# Altium project nizn.PrjPCB
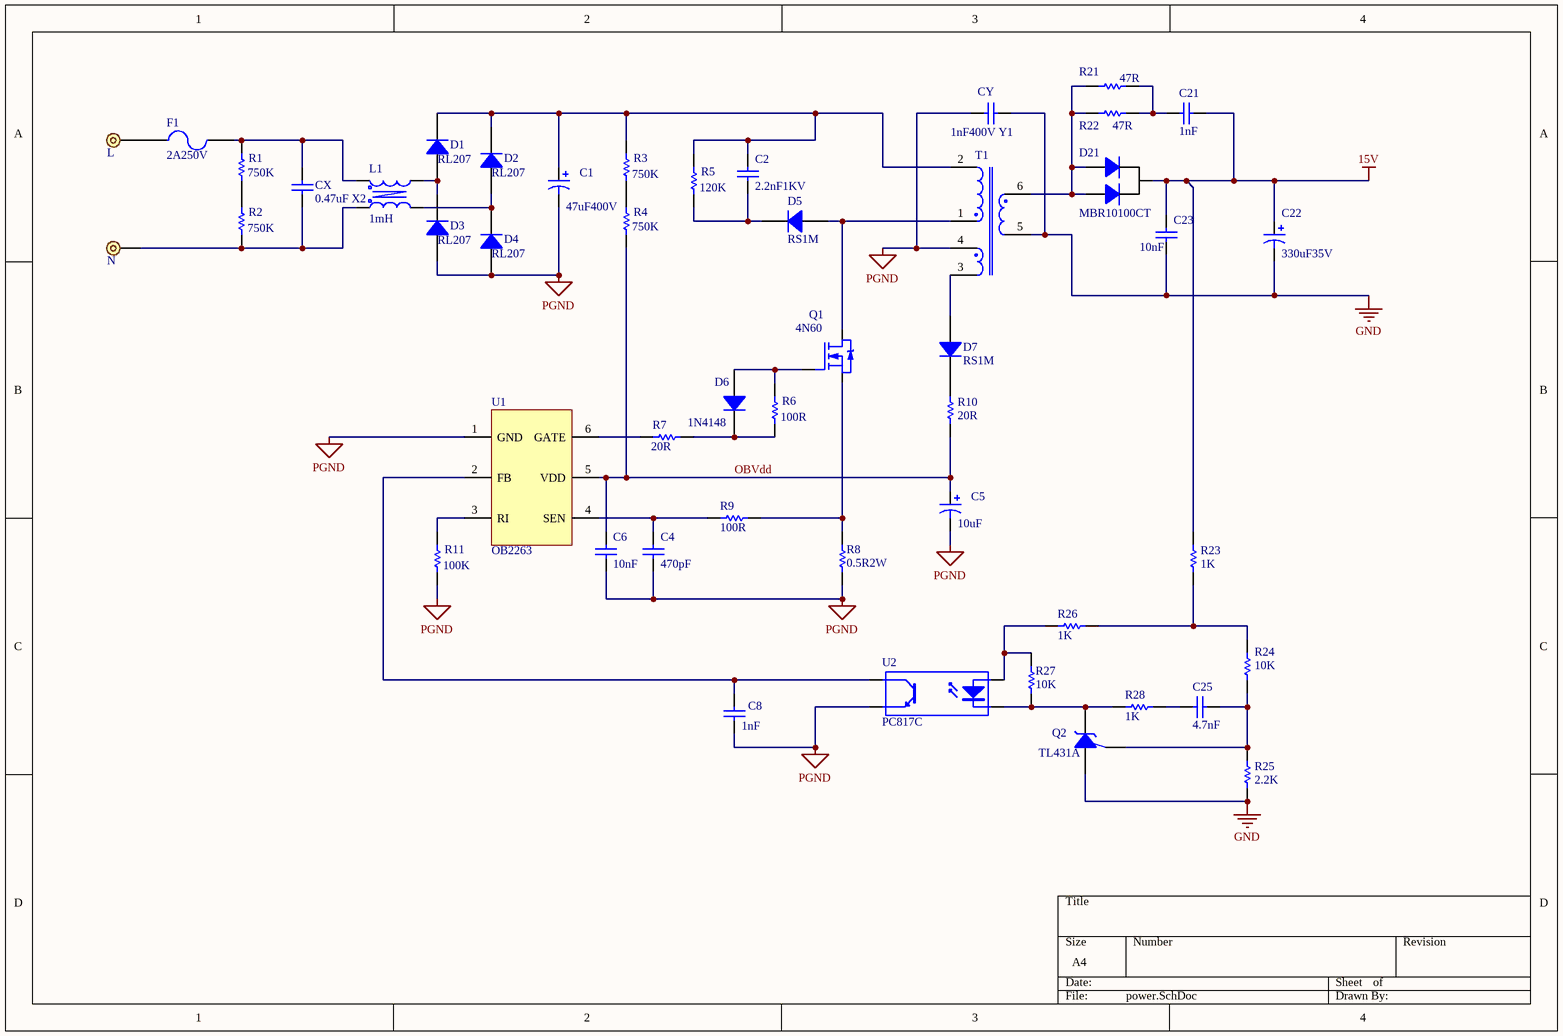
[diagram p0: power.SchDoc]
2 sheets, 86 parts. Net scope: global (net labels, ports and power ports of the same name join across sheets).
Board file: nizn.PcbDoc
Sheets:
  power.SchDoc
  charger.SchDoc

## Sheet power.SchDoc
size A4; PageSetup: Record=PageOptions|CenterHorizontal=True|CenterVertical=True|PrintScale=0.97|XCorrection=1.00|YCorrection=1.00|PrintKind=0|BorderSize=5000000|LeftOffset=0|BottomOffset=0|Orientation=2|PaperLength=1000|PaperWidth=1000|Scale=100|PaperSource=7|PrintQuality=-4|MediaType=1|DitherType=10|PaperKind=A4|PrintScaleMode=1

### Parts
C1  47uF400V  [CAP16x25]
C2  value 2.2nF1KV  [CAP5]  (hidden comment: Cap)
C4  value 470pF  [CAP0805]  (hidden comment: Cap)
C5  10uF  [CAP3]
C6  value 10nF  [CAP0805]  (hidden comment: Cap)
C8  value 1nF  [CAP0805]  (hidden comment: Cap)
C21  value 1nF  [CAP1206]  (hidden comment: Cap)
C22  330uF35V  [CAP10X16]
C23  value 10nF  [CAP0805]  (hidden comment: Cap)
C25  value 4.7nF  [CAP0805]  (hidden comment: Cap)
CX  value 0.47uF X2  [CAPX2]  (hidden comment: Cap)
CY  value 1nF400V Y1  [CAPY2]  (hidden comment: Cap)
D1  RL207  [DIO10mm]
D2  RL207  [DIO10mm]
D3  RL207  [DIO10mm]
D4  RL207  [DIO10mm]
D5  RS1M  [DO214A]
D6  1N4148  [1N4148SMT]
D7  RS1M  [DO214A]
D21  MBR10100CT  [TO220DIO_HS]
F1  2A250V  [FUSE3X10_2]
J1  L  [PAD1]
J2  N  [PAD1]
L1  1mH  [BU10]
Q1  4N60  [TO220MOS_HS]
Q2  TL431A  [SOT23_431]
R1  value 750K  [RES1206]  (hidden comment: Res1)
R2  value 750K  [RES1206]  (hidden comment: Res1)
R3  value 750K  [RES1206]  (hidden comment: Res1)
R4  value 750K  [RES1206]  (hidden comment: Res1)
R5  value 120K  [RES1206]  (hidden comment: Res1)
R6  value 100R  [RES0805]  (hidden comment: Res1)
R7  value 20R  [RES0805]  (hidden comment: Res1)
R8  value 0.5R2W  [RES2W]  (hidden comment: Res1)
R9  value 100R  [RES0805]  (hidden comment: Res1)
R10  value 20R  [RES1206]  (hidden comment: Res1)
R11  value 100K  [RES0805]  (hidden comment: Res1)
R21  value 47R  [RES1206]  (hidden comment: Res1)
R22  value 47R  [RES1206]  (hidden comment: Res1)
R23  value 1K  [RES0805]  (hidden comment: Res1)
R24  value 10K  [RES0805]  (hidden comment: Res1)
R25  value 2.2K  [RES0805]  (hidden comment: Res1)
R26  value 1K  [RES0805]  (hidden comment: Res1)
R27  value 10K  [RES0805]  (hidden comment: Res1)
R28  value 1K  [RES0805]  (hidden comment: Res1)
T1  Transformer  [PQ20C1]  (value not drawn)
U1  OB2263  [SOT23-6]
U2  PC817C  [DIP-4]

### Nets
15V: C21.1 C22.1 C23.2 D21.2(K) R23.1
GND: C22.2 C23.1 CY.1 Q2.2(A) R25.1 T1.5
PGND: C1.2 C4.1 C5.2 C6.1 C8.1 CY.2 D3.1(A) D4.1(A) R8.2 R11.1 T1.4 U1.1(GND) U2.3(E)
OBVdd: C5.1 C6.2 R4.1 R10.2 U1.5(VDD)
NetC1_1: C1.1 C2.2 D1.2(K) D2.2(K) R3.2 R5.2 T1.2
NetC2_1: C2.1 D5.2(K) R5.1
NetC4_2: C4.2 R9.2 U1.4(SEN)
NetC8_2: C8.2 U1.2(FB) U2.4(C)
NetC21_2: C21.2 R21.1 R22.1
NetC25_1: C25.1 Q2.1(R) R24.1 R25.2
NetC25_2: C25.2 R28.1
NetCX_1: CX.1 J2.1 L1.4 R2.1
NetCX_2: CX.2 F1.2 L1.1 R1.2
NetD1_1: D1.1(A) D3.2(K) L1.2
NetD2_1: D2.1(A) D4.2(K) L1.3
NetD5_1: D5.1(A) Q1.D T1.1
NetD6_1: D6.1(A) Q1.G R6.2
NetD6_2: D6.2(K) R6.1 R7.1
NetD7_1: D7.1(A) T1.3
NetD7_2: D7.2(K) R10.1
NetD21_1: D21.1(A) D21.3(A) R21.2 R22.2 T1.6
NetF1_1: F1.1 J1.1
NetQ1_S: Q1.S R8.1 R9.1
NetQ2_3: Q2.3(C) R27.1 R28.2 U2.2(K)
NetR1_1: R1.1 R2.2
NetR3_1: R3.1 R4.2
NetR7_2: R7.2 U1.6(GATE)
NetR11_2: R11.2 U1.3(RI)
NetR23_2: R23.2 R24.2 R26.2
NetR26_1: R26.1 R27.2 U2.1(A)

### Library data of the parts
C1 C5 C22 = Cap Pol2: 电解电容; Published: 8-Jun-2000; LatestRevisionDate: 17-Jul-2002; LatestRevisionNote: Re-released for DXP Platform.; Publisher: Altium Limited
C2 = Cap: 涤纶电容; Published: 8-Jun-2000; LatestRevisionDate: 17-Jul-2002; LatestRevisionNote: Re-released for DXP Platform.; PackageReference: RAD-0.3; Publisher: Altium Limited; PackageDescription: Radial Cap, Thru-Hole; 2 Leads; 0.3 in Pin Spacing
C4 C6 C8 C21 C23 C25 = Cap: 贴片电容; Published: 8-Jun-2000; LatestRevisionDate: 17-Jul-2002; LatestRevisionNote: Re-released for DXP Platform.; PackageReference: RAD-0.3; Publisher: Altium Limited; PackageDescription: Radial Cap, Thru-Hole; 2 Leads; 0.3 in Pin Spacing
CX = Cap: X2 安规电容; Published: 8-Jun-2000; LatestRevisionDate: 17-Jul-2002; LatestRevisionNote: Re-released for DXP Platform.; PackageReference: RAD-0.3; Publisher: Altium Limited; PackageDescription: Radial Cap, Thru-Hole; 2 Leads; 0.3 in Pin Spacing
CY = Cap: Y2 安规电容; Published: 8-Jun-2000; LatestRevisionDate: 17-Jul-2002; LatestRevisionNote: Re-released for DXP Platform.; PackageReference: RAD-0.3; Publisher: Altium Limited; PackageDescription: Radial Cap, Thru-Hole; 2 Leads; 0.3 in Pin Spacing
D1-D4 = Diode: 直插二极管; Published: 8-Jun-2000; LatestRevisionDate: 17-Jul-2002; LatestRevisionNote: Re-released for DXP Platform.; DatasheetDocument: 1999; PackageDocument: Aug-1999; PackageReference: DO-41; Publisher: Altium Limited; ComponentLink1Description: Manufacturer Link; ComponentLink1URL: http://www.fairchildsemi.com/; Code_JEDEC: DO-204-AL
D5-D7 = Diode: 贴片二极管; Published: 8-Jun-2000; LatestRevisionDate: 17-Jul-2002; LatestRevisionNote: Re-released for DXP Platform.; DatasheetDocument: 1999; PackageDocument: Aug-1999; PackageReference: DO-41; Publisher: Altium Limited; ComponentLink1Description: Manufacturer Link; ComponentLink1URL: http://www.fairchildsemi.com/; Code_JEDEC: DO-204-AL
D21 = Diode2: 整流双二极管; Published: 8-Jun-2000; LatestRevisionDate: 17-Jul-2002; LatestRevisionNote: Re-released for DXP Platform.; DatasheetDocument: 1999; PackageDocument: Aug-1999; PackageReference: DO-41; Publisher: Altium Limited; ComponentLink1Description: Manufacturer Link; ComponentLink1URL: http://www.fairchildsemi.com/; Code_JEDEC: DO-204-AL
F1 = Fuse 2: 直插保险丝; Published: 8-Jun-2000; LatestRevisionDate: 17-Jul-2002; LatestRevisionNote: Re-released for DXP Platform.; Publisher: Altium Limited
J1 = Header1: 电源火线; LatestRevisionDate: 17-Jul-2002; LatestRevisionNote: Re-released for DXP Platform.; Publisher: Altium Limited
J2 = Header1: 电源零线; LatestRevisionDate: 17-Jul-2002; LatestRevisionNote: Re-released for DXP Platform.; Publisher: Altium Limited
L1 = TRANS3: 共模电感
Q1 = NMOS: 高压 NMOS; Published: 8-Jun-2000; LatestRevisionDate: 17-Jul-2002; LatestRevisionNote: Re-released for DXP Platform.; PackageVersion: 1995/1996; PackageReference: E3; Publisher: Altium Limited; PackageDescription: TO, Flat Index; 3 In-Line, Axial Leads; Body Dia. 4.6mm; Lead Dia. 0.5 mm (max)
Q2 = TL431: 基准集成电路; Accuracy: 0.5%; Published: 8-Jun-2000; LatestRevisionDate: 17-Jul-2002; LatestRevisionNote: Re-released for DXP Platform.; Publisher: Altium Limited
R1-R7 R9-R11 R21 R22 = Res1: 贴片电阻; Accuracy: 5%; Published: 8-Jun-2000; LatestRevisionDate: 17-Jul-2002; LatestRevisionNote: Re-released for DXP Platform.; PackageReference: AXIAL-0.3; Publisher: Altium Limited; PackageDescription: Axial Device, Thru-Hole; 2 Leads; 0.3 in Pin Spacing
R8 = Res1: 2W 直插电阻; Published: 8-Jun-2000; LatestRevisionDate: 17-Jul-2002; LatestRevisionNote: Re-released for DXP Platform.; PackageReference: AXIAL-0.3; Publisher: Altium Limited; PackageDescription: Axial Device, Thru-Hole; 2 Leads; 0.3 in Pin Spacing
R23-R28 = Res1: 贴片电阻; Accuracy: 1%; Published: 8-Jun-2000; LatestRevisionDate: 17-Jul-2002; LatestRevisionNote: Re-released for DXP Platform.; PackageReference: AXIAL-0.3; Publisher: Altium Limited; PackageDescription: Axial Device, Thru-Hole; 2 Leads; 0.3 in Pin Spacing
T1 = PQ20C1: 变压器; Published: 24-Mar-1999; LatestRevisionDate: 17-Jul-2002; LatestRevisionNote: Re-released for DXP Platform.; Publisher: Altium Limited
U1 = OB2263: 集成电路
U2 = Optoisolator1: 光耦; Published: 24-Mar-1999; LatestRevisionDate: 4-Mar-2005; LatestRevisionNote: Sch pins 3 & 4 Swapped.; DatasheetDocument: Nov-2003; PackageReference: DIP-4; Publisher: Altium Limited

## Sheet charger.SchDoc
size A4; PageSetup: Record=PageOptions|CenterHorizontal=True|CenterVertical=True|PrintScale=0.97|XCorrection=1.00|YCorrection=1.00|PrintKind=0|BorderSize=5000000|LeftOffset=0|BottomOffset=0|Orientation=2|PaperLength=1000|PaperWidth=1000|Scale=100|PaperSource=7|PrintQuality=-4|MediaType=1|DitherType=10|PaperKind=A4|PrintScaleMode=1
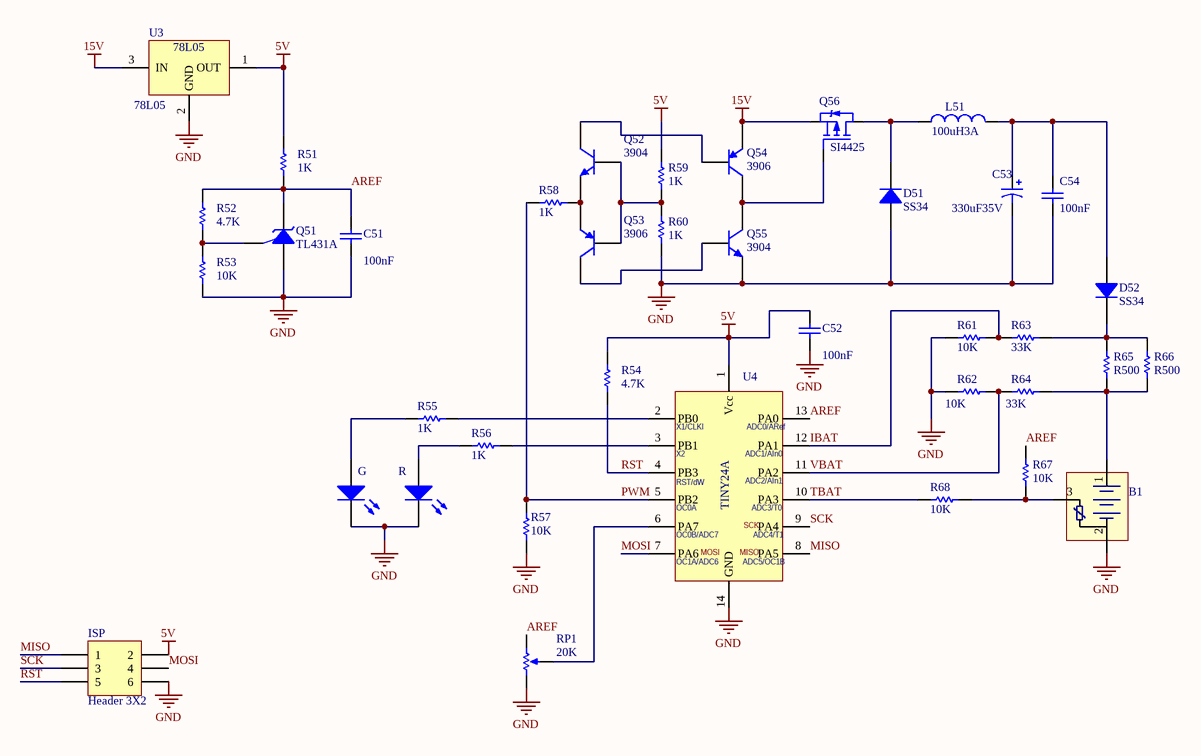
[diagram p1: charger.SchDoc]

### Parts
B1  BATT  [BATT]  (value not drawn)
C51  value 100nF  [CAP0805]  (hidden comment: Cap)
C52  value 100nF  [CAP0805]  (hidden comment: Cap)
C53  330uF35V  [CAP10x16]
C54  value 100nF  [CAP0805]  (hidden comment: Cap)
D51  SS34  [DO214A]
D52  SS34  [DO214A]
G  高亮翠绿  [LED2G_SLIM]  (value not drawn)
ISP  Header 3X2  [HDR2X3_EMPTY]
L51  100uH3A  [INDUCTOR]
Q51  TL431A  [SOT23_431]
Q52  3904  [SOT23_CBE]
Q53  3906  [SOT23_CBE]
Q54  3906  [SOT23_CBE]
Q55  3904  [SOT23_CBE]
Q56  SI4425  [SO8-MOS]
R  高亮红  [LED2R_SLIM]  (value not drawn)
R51  value 1K  [RES0805]  (hidden comment: Res1)
R52  value 4.7K  [RES0805]  (hidden comment: Res1)
R53  value 10K  [RES0805]  (hidden comment: Res1)
R54  value 4.7K  [RES0805]  (hidden comment: Res1)
R55  value 1K  [RES0805]  (hidden comment: Res1)
R56  value 1K  [RES0805]  (hidden comment: Res1)
R57  value 10K  [RES0805]  (hidden comment: Res1)
R58  value 1K  [RES0805]  (hidden comment: Res1)
R59  value 1K  [RES0805]  (hidden comment: Res1)
R60  value 1K  [RES0805]  (hidden comment: Res1)
R61  value 10K  [RES0805]  (hidden comment: Res1)
R62  value 10K  [RES0805]  (hidden comment: Res1)
R63  value 33K  [RES0805]  (hidden comment: Res1)
R64  value 33K  [RES0805]  (hidden comment: Res1)
R65  value R500  [RES2512]  (hidden comment: Res1)
R66  value R500  [RES2512]  (hidden comment: Res1)
R67  value 10K  [RES0805]  (hidden comment: Res1)
R68  value 10K  [RES0805]  (hidden comment: Res1)
RP1  value 20K  [POT3x3]  (hidden comment: RPot)
U3  78L05  [SOT89_VREG]
U4  TINY24A  [SO14]  (value not drawn)

### Nets
5V: C52.2 ISP.2 R51.2 R54.2 R59.2 U3.1(OUT) U4.1(Vcc)
15V: Q54.E Q56.S U3.3(IN)
GND: B1.2(B-) C51.1 C52.1 C53.2 C54.1 D51.1(A) G.2(K) ISP.6 Q51.2(A) Q55.E R.2(K) R53.1 R57.2 R60.1 R61.2 R62.2 RP1.1(TOP) U3.2(GND) U4.14(GND)
AREF: C51.2 Q51.3(C) R51.1 R52.2 R67.2 RP1.2(BOT) U4.13(PA0)
IBAT: R61.1 R63.2 U4.12(PA1)
MISO: ISP.1 U4.8(PA5)
MOSI: ISP.4 U4.7(PA6)
PWM: R57.1 R58.2 U4.5(PB2)
RST: ISP.5 R54.1 U4.4(PB3)
SCK: ISP.3 U4.9(PA4)
TBAT: R68.2 U4.10(PA3)
VBAT: R62.1 R64.2 U4.11(PA2)
NetB1_1: B1.1(B+) R64.1 R65.1 R66.1
NetB1_3: B1.3(T) R67.1 R68.1
NetC53_1: C53.1 C54.2 D52.1(A) L51.2
NetD51_2: D51.2(K) L51.1 Q56.D
NetD52_2: D52.2(K) R63.1 R65.2 R66.2
NetG_1: G.1(A) R55.2
NetQ51_1: Q51.1(R) R52.1 R53.2
NetQ52_B: Q52.B Q53.B R59.1 R60.2
NetQ52_C: Q52.C Q54.B
NetQ52_E: Q52.E Q53.E R58.1
NetQ53_C: Q53.C Q55.B
NetQ54_C: Q54.C Q55.C Q56.G
NetR55_1: R55.1 U4.2(PB0)
NetR56_1: R56.1 U4.3(PB1)
NetR_1: R.1(A) R56.2
NetRP1_3: RP1.3(TAP) U4.6(PA7)

### Notes on the sheet
- (in symbol TINY13A) X1/CLKI; ADC0/ARef; X2; ADC1/AIn0; RST/dW; ADC2/AIn1; OC0A; ADC3/T0; SCK; OC0B/ADC7; ADC4/T1; MOSI; MISO; OC1A/ADC6; ADC5/OC1B

### Library data of the parts
B1 = BATT: 电池座
C51 C52 C54 = Cap: 贴片电容; Published: 8-Jun-2000; LatestRevisionDate: 17-Jul-2002; LatestRevisionNote: Re-released for DXP Platform.; PackageReference: RAD-0.3; Publisher: Altium Limited; PackageDescription: Radial Cap, Thru-Hole; 2 Leads; 0.3 in Pin Spacing
C53 = Cap Pol2: 电解电容; Published: 8-Jun-2000; LatestRevisionDate: 17-Jul-2002; LatestRevisionNote: Re-released for DXP Platform.; Publisher: Altium Limited
D51 D52 = Diode: 贴片二极管; Published: 8-Jun-2000; LatestRevisionDate: 17-Jul-2002; LatestRevisionNote: Re-released for DXP Platform.; DatasheetDocument: 1999; PackageDocument: Aug-1999; PackageReference: DO-41; Publisher: Altium Limited; ComponentLink1Description: Manufacturer Link; ComponentLink1URL: http://www.fairchildsemi.com/; Code_JEDEC: DO-204-AL
G R = LED: 贴片二极管 0805; Published: 8-Jun-2000; LatestRevisionDate: 08-Jul-2005; LatestRevisionNote: Mech Layer 1 removed.; PackageReference: LED-0; Publisher: Altium Limited; PackageDescription: LED; 2 Leads
ISP = Header 3X2: 空; LatestRevisionDate: 17-Jul-2002; LatestRevisionNote: Re-released for DXP Platform.; Publisher: Altium Limited
L51 = Inductor: 工字电感; Code_IEC: 1005; Published: 8-Jun-2000; LatestRevisionDate: 17-Jul-2002; LatestRevisionNote: Re-released for DXP Platform.; PackageReference: 0402-A; Publisher: Altium Limited; Code_JEITA: 0402
Q51 = TL431: 基准集成电路; Accuracy: 0.5%; Published: 8-Jun-2000; LatestRevisionDate: 17-Jul-2002; LatestRevisionNote: Re-released for DXP Platform.; Publisher: Altium Limited
Q52 Q55 = NPN: NPN 三极管; Published: 8-Jun-2000; LatestRevisionDate: 17-Jul-2002; LatestRevisionNote: Re-released for DXP Platform.; PackageReference: TO-226-AA; Publisher: Altium Limited; PackageDescription: TO, Flat Index; 3 In-Line, Axial Leads; Body Dia. 4.8mm; Leads 0.55 x 0.51 mm (max); Code_JEDEC: TO-226-AA
Q53 Q54 = PNP: PNP 三极管; Published: 8-Jun-2000; LatestRevisionDate: 15-Jan-2003; LatestRevisionNote: PCB Footprint 'BCY-W3/D4.7' replaced; DatasheetVersion: 1997; PackageVersion: Sep-1998; PackageReference: TO-92A; Publisher: Altium Limited; PackageDescription: TO, Flat Index; 3 In-Line, Axial Leads; Body Dia. 4.5mm; Leads 0.51 x 0.48 mm (max); ComponentLink1Description: Manufacturer Link; ComponentLink1URL: http://www.fairchildsemi.com/; ComponentLink2Description: Datasheet; ComponentLink2URL: http://www.fairchildsemi.com/ds/2N%2F2N3906.pdf
Q56 = PMOS: 低压 PMOS; Published: 8-Jun-2000; LatestRevisionDate: 17-Jul-2002; LatestRevisionNote: Re-released for DXP Platform.; PackageVersion: 1995/1996; PackageReference: E3; Publisher: Altium Limited; PackageDescription: TO, Flat Index; 3 In-Line, Axial Leads; Body Dia. 4.6mm; Lead Dia. 0.5 mm (max)
R51-R64 R67 R68 = Res1: 贴片电阻; Accuracy: 1%; Published: 8-Jun-2000; LatestRevisionDate: 17-Jul-2002; LatestRevisionNote: Re-released for DXP Platform.; PackageReference: AXIAL-0.3; Publisher: Altium Limited; PackageDescription: Axial Device, Thru-Hole; 2 Leads; 0.3 in Pin Spacing
R65 R66 = Res1: 贴片电阻; Published: 8-Jun-2000; LatestRevisionDate: 17-Jul-2002; LatestRevisionNote: Re-released for DXP Platform.; PackageReference: AXIAL-0.3; Publisher: Altium Limited; PackageDescription: Axial Device, Thru-Hole; 2 Leads; 0.3 in Pin Spacing
RP1 = RPot: 贴片电位器; Sim Note: Enter the Resistance value and the set point into parameter fields.; Set Position: 0.5; Published: 8-Jun-2000; LatestRevisionDate: 17-Jul-2002; LatestRevisionNote: Re-released for DXP Platform.; PackageReference: VR5; Publisher: Altium Limited; PackageDescription: Variable Resistor, Thru-Hole; 3 Leads
U3 = 78L05: 三端稳压贴片; Published: 24-Aug-2001; LatestRevisionDate: 6-Jun-2005; LatestRevisionNote: PCB pads lengthened.; DatasheetDocument: Apr-1994; PackageDocument: Jun-2004; PackageReference: TO-252; Publisher: Altium Limited; ComponentLink1Description: Manufacturer Link; ComponentLink1URL: http://www.st.com/
U4 = TINY13A: 集成电路

## Nets that join several sheets
15V: power (5 pins), charger (Q54.E Q56.S U3.3)
GND: power (6 pins), charger (19 pins)